# Altium schematic sheet OZ440-SE100-CAR003_sheet6.SchDoc
size A3
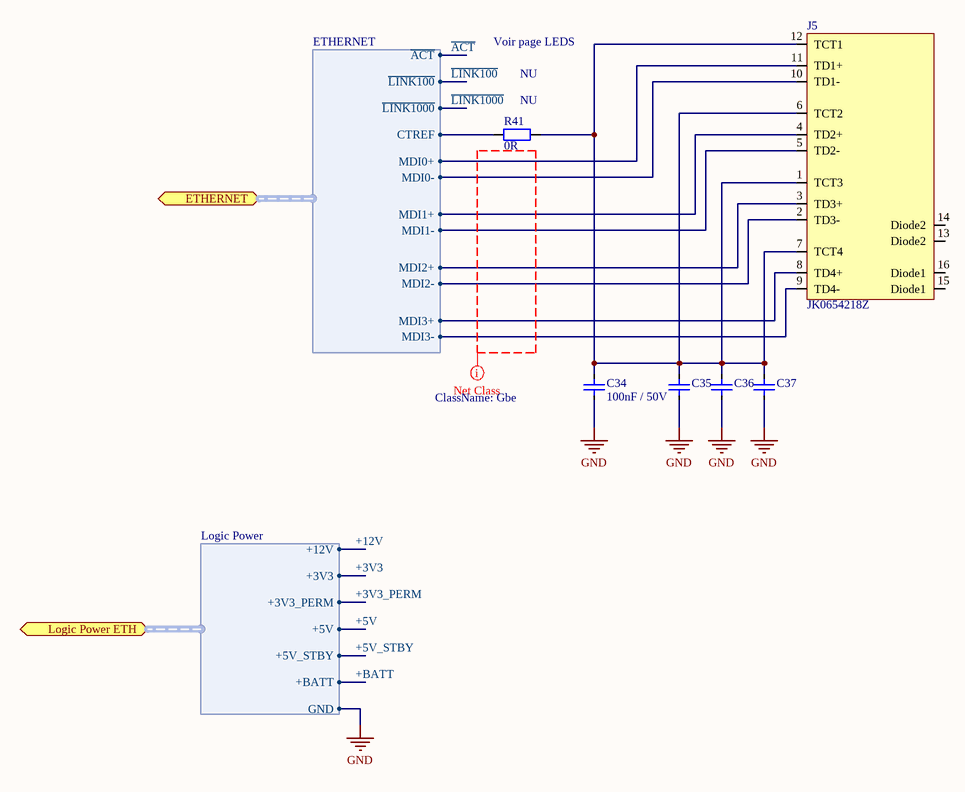
[diagram p0: OZ440-SE100-CAR003_sheet6.SchDoc]

## Parts
C34  Displayed reference: 100nF / 50V  [C0805-STD]  (hidden comment: CAP-SMD)
C35  CAP-SMD  [C0805-STD]  (value not drawn)
C36  CAP-SMD  [C0805-STD]  (value not drawn)
C37  CAP-SMD  [C0805-STD]  (value not drawn)
J5  Displayed reference: JK0654218Z  [TR-SPE-PULSE_JK0654X1XX]  (hidden comment: CONN_GIG_TF-SPE-PULSE_JK0654218Z)
R41  Displayed reference: 0R  [R0805-STD]  (hidden comment: RES-SMD)

## Ports
ETHERNET (harness ETHERNET), Logic Power ETH (harness Logic Power)

## Harnesses
ETHERNET: ~{ACT}, ~{LINK100}, ~{LINK1000}, CTREF, MDI0-, MDI0+, MDI1-, MDI1+, MDI2-, MDI2+, MDI3-, MDI3+
Logic Power: +12V, +3V3, +3V3_PERM, +5V, +5V_STBY, +BATT, GND

## Nets
GND: C34.1 C35.1 C36.1 C37.1 ; port Logic Power ETH.GND
+3V3: port Logic Power ETH.+3V3
+3V3_PERM: port Logic Power ETH.+3V3_PERM
+5V: port Logic Power ETH.+5V
+5V_STBY: port Logic Power ETH.+5V_STBY
+12V: port Logic Power ETH.+12V
+BATT: port Logic Power ETH.+BATT
~{ACT}: port ETHERNET.~{ACT}
~{LINK100}: port ETHERNET.~{LINK100}
~{LINK1000}: port ETHERNET.~{LINK1000}
NetC34_2: C34.2 C35.2 C36.2 C37.2 J5.1(TCT3) J5.6(TCT2) J5.7(TCT4) J5.12(TCT1) R41.2
NetJ5_2: J5.2(TD3-) ; port ETHERNET.MDI2-
NetJ5_3: J5.3(TD3+) ; port ETHERNET.MDI2+
NetJ5_4: J5.4(TD2+) ; port ETHERNET.MDI1+
NetJ5_5: J5.5(TD2-) ; port ETHERNET.MDI1-
NetJ5_8: J5.8(TD4+) ; port ETHERNET.MDI3+
NetJ5_9: J5.9(TD4-) ; port ETHERNET.MDI3-
NetJ5_10: J5.10(TD1-) ; port ETHERNET.MDI0-
NetJ5_11: J5.11(TD1+) ; port ETHERNET.MDI0+
NetR41_1: R41.1 ; port ETHERNET.CTREF

Not connected (* = marked no-connect by the designer): J5 13(Diode2) 14(Diode2) 15(Diode1) 16(Diode1)

## Layout directives
net class Gbe: (no net found under the mark)

## Notes on the sheet
- Voir page LEDS
- (near R41) NU
- Titre document:
- NAIO TECHNOLOGIES
- 3 Av didier Daurat
- 31400 TOULOUSE
- Auteur:
- Numéro document:
- Verificateur:
- Format:
- A3
- Date:
- Revision:
- Page:
- /

## Library data of the parts
C34-C37 = VJ0805Y104KXAxx: 0805 100nF / 50V  X7R ceramic capacitor; Manufacturer: vishay; Max Voltage: 50; Tolerance: +/- 10%; Validated: N; Reference: VJ0805Y104KXAxx; Value: 100nF; Material: X7R; Footprint description: standard Capacitor 0805; Pin Count: 2; helpURL: http://www.vishay.com/docs/45200/highrels.pdf; Supplier 1: Farnell; Supplier Part Number 1: 1612208; Supplier 2: Digi-Key; Supplier Part Number 2: 720-1266-6-ND
  C35-C37: Displayed reference: 100nF / 50V
J5 = JK0654218Z: Gigabit ethernet xformer with connector; Manufacturer: PULSE; Gain: 1:1; Validated: False; Reference: JK0654218Z; Footprint description: SMD 16 pin; Pin Count: 16; helpURL: http://www.mouser.com/ds/2/336/Pulse%20JK%20Series-198037.pdf; Supplier 1: Mouser; Supplier Part Number 1: 673-JK0654218ZNL
R41 = CRCW08050000Z0xx: 0 Ohm 0805 SMD resistor; Manufacturer: Vishay; Value: 0; Tolerance: 1%; Rated Power: 0.125W; Validated: No; Reference: CRCW08050000Z0xx; Footprint description: standard 0805 SMD; Pin Count: 2; helpURL: http://www.vishay.com/docs/20035/dcrcwe3.pdf; Supplier 1: Farnell; Supplier Part Number 1: 1469846; Supplier 2: Mouser; Supplier Part Number 2: 71-CRCW0805-0-E3